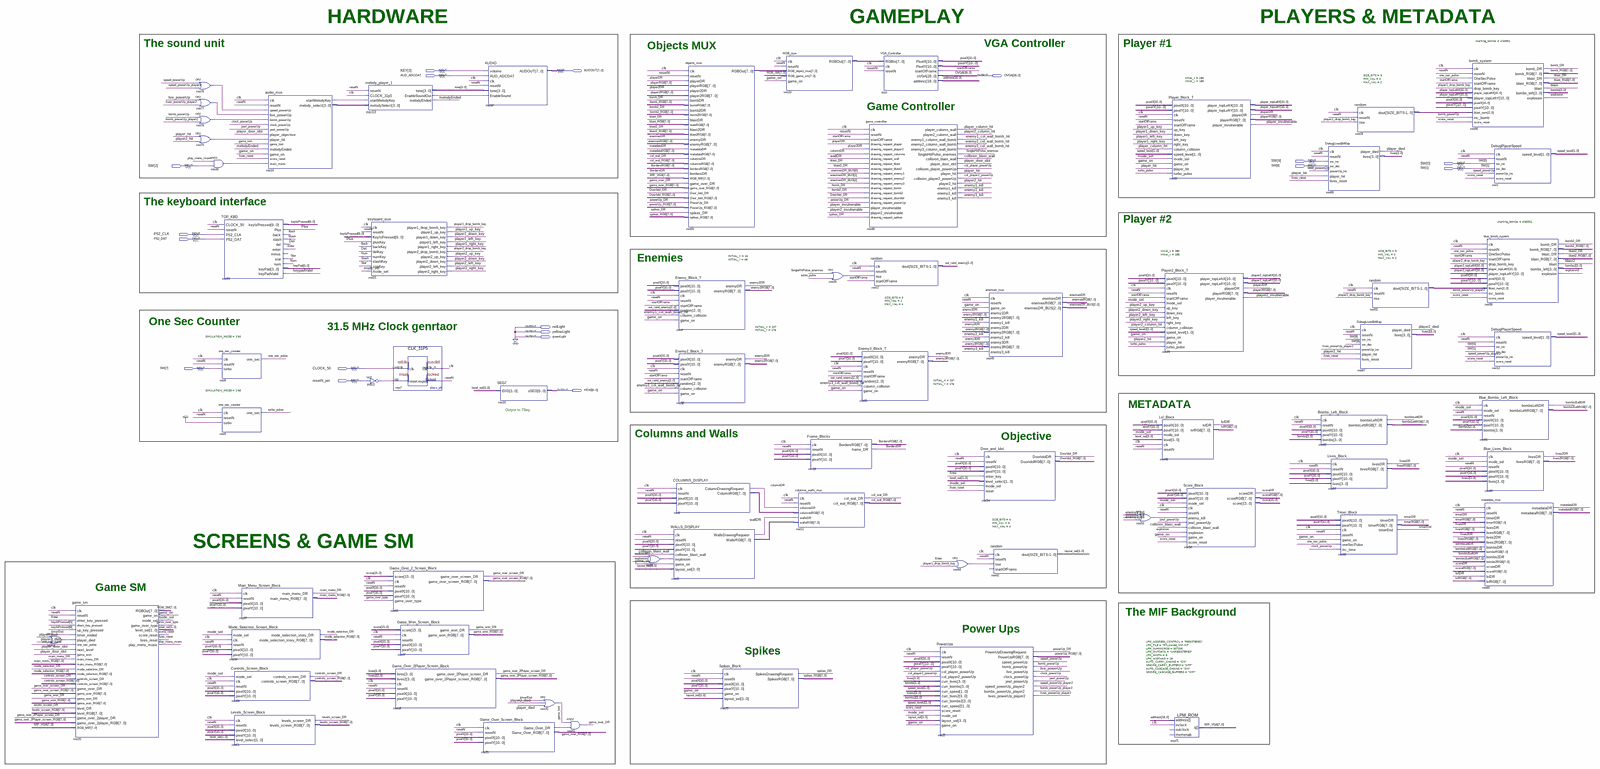
[diagram p0: schematic sheet, whole]
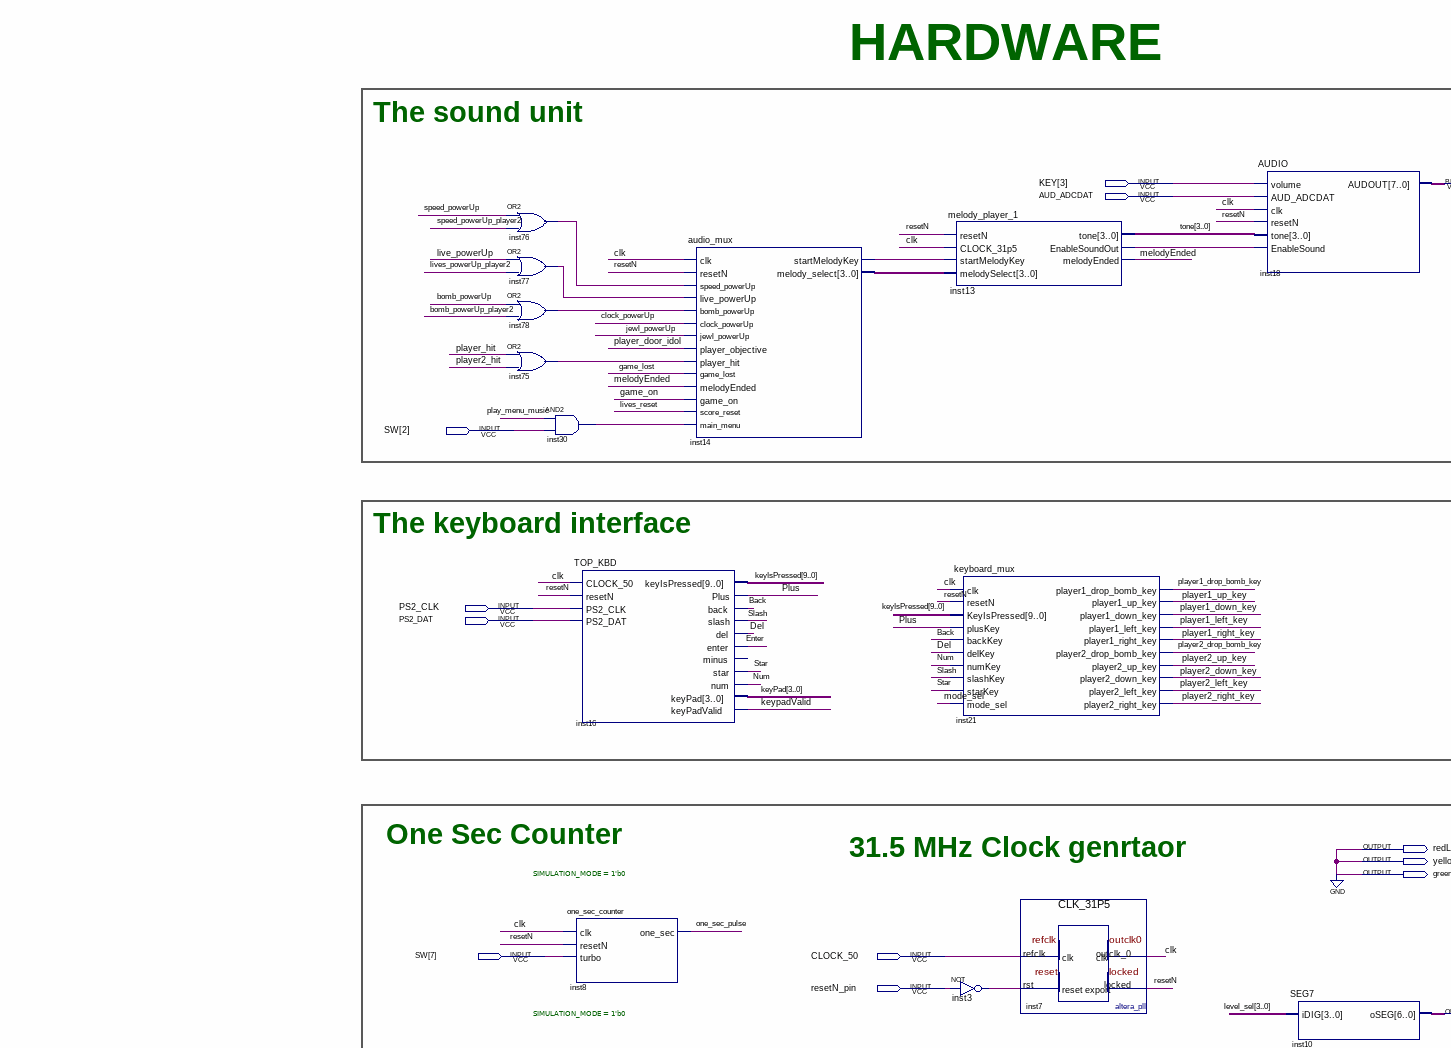
[diagram p1: schematic sheet, upper left part]
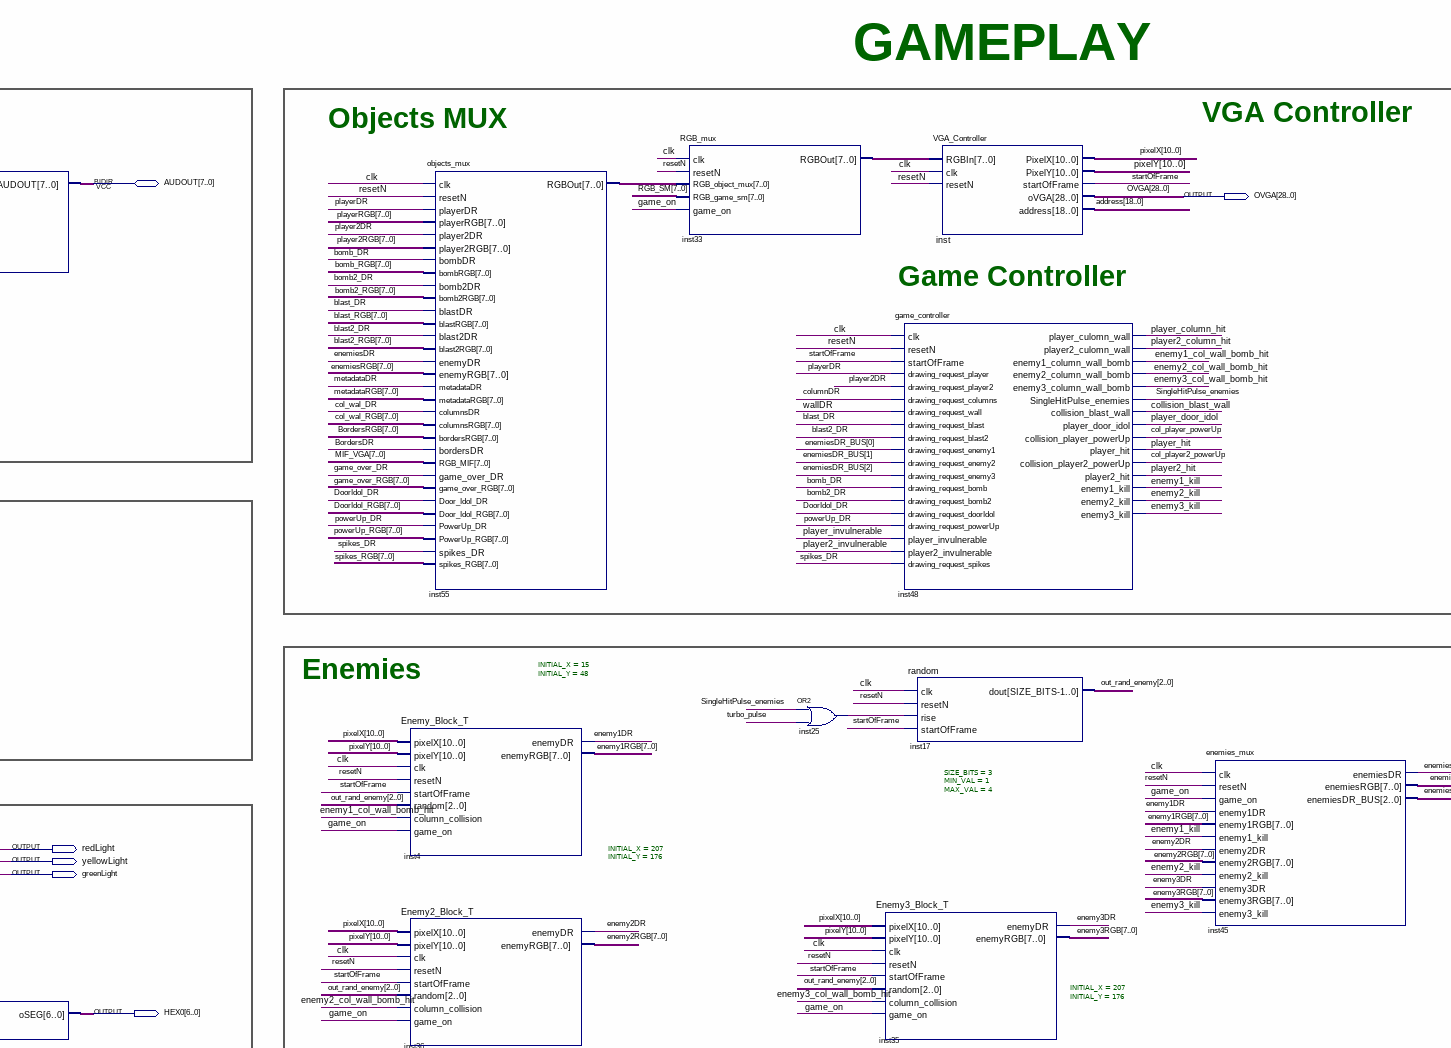
[diagram p2: schematic sheet, upper centre part]
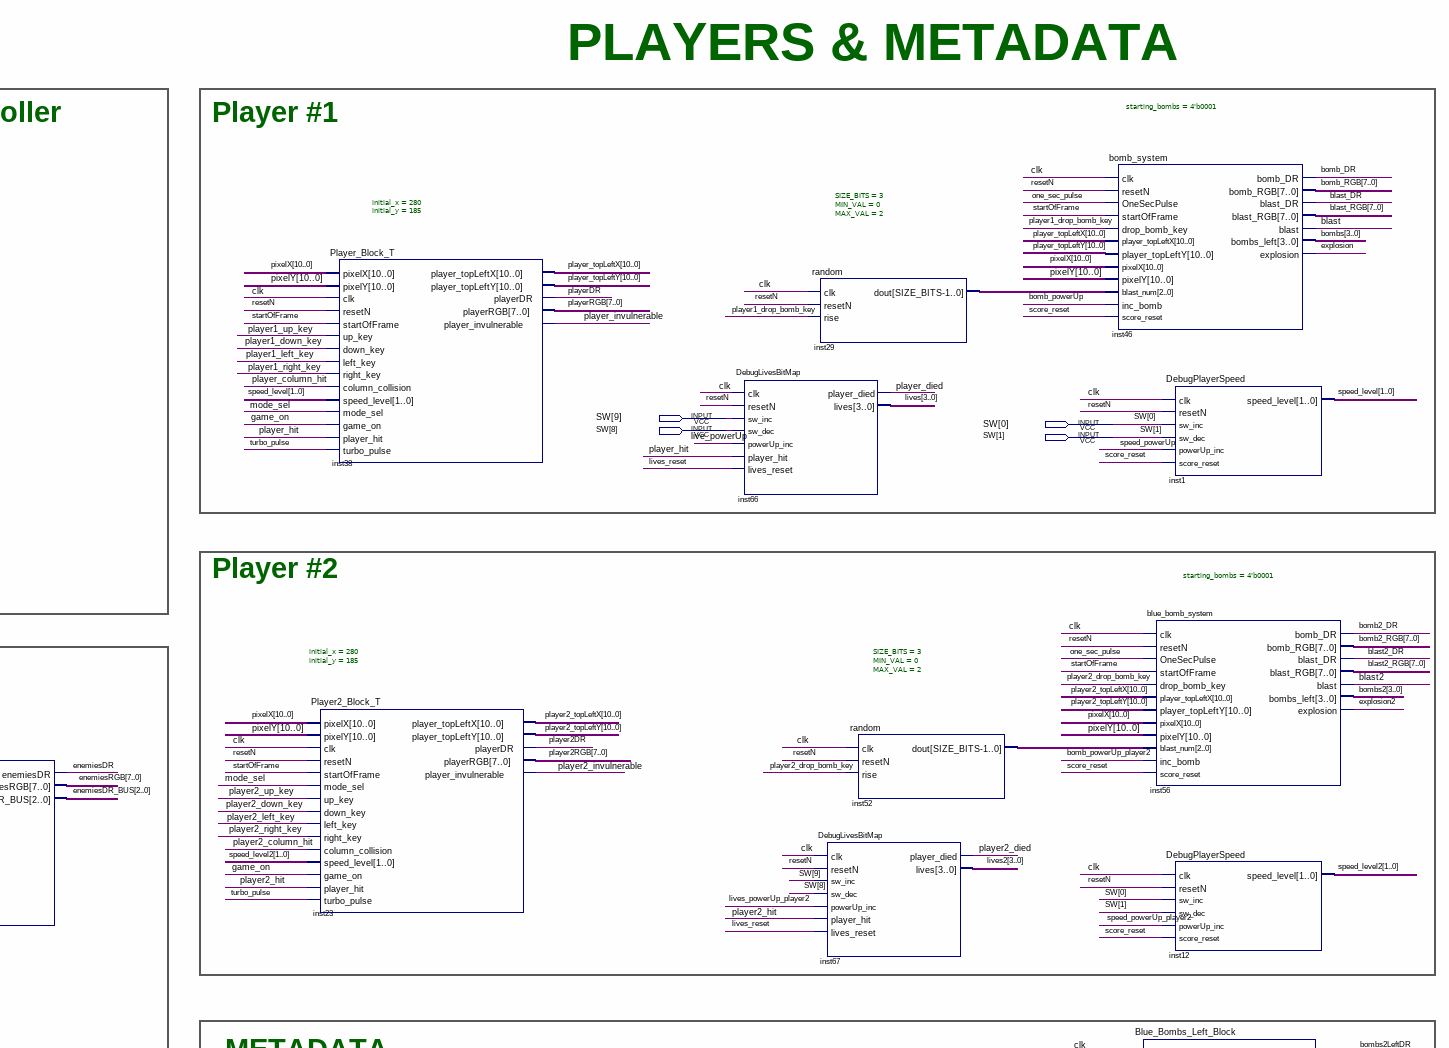
[diagram p3: schematic sheet, upper right part]
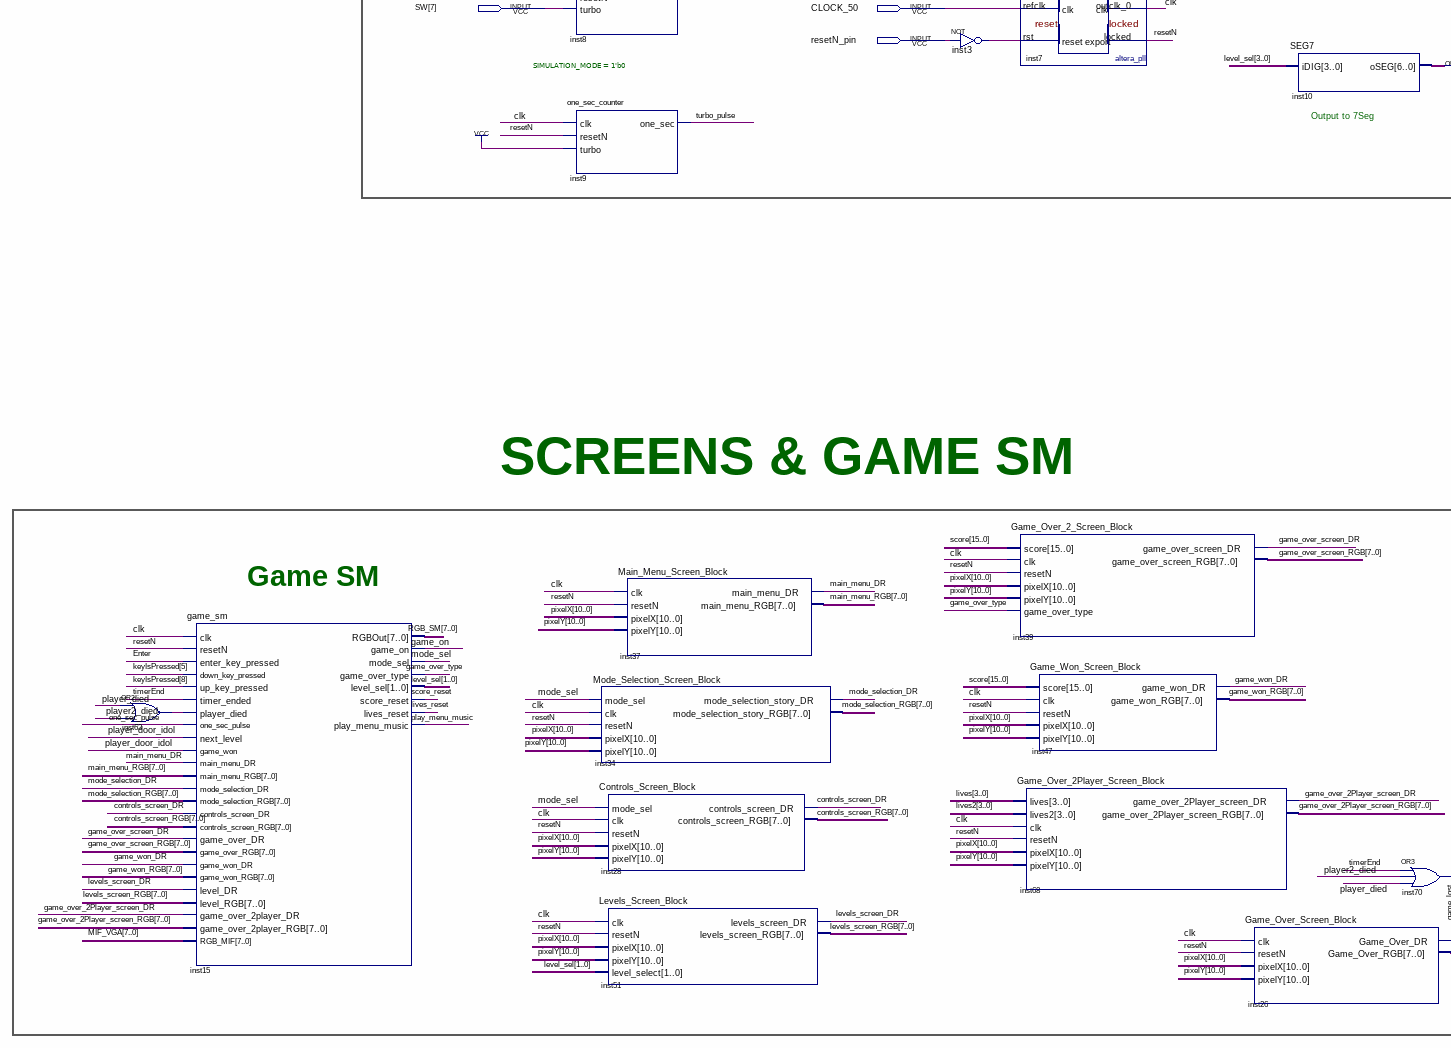
[diagram p4: schematic sheet, lower left part]
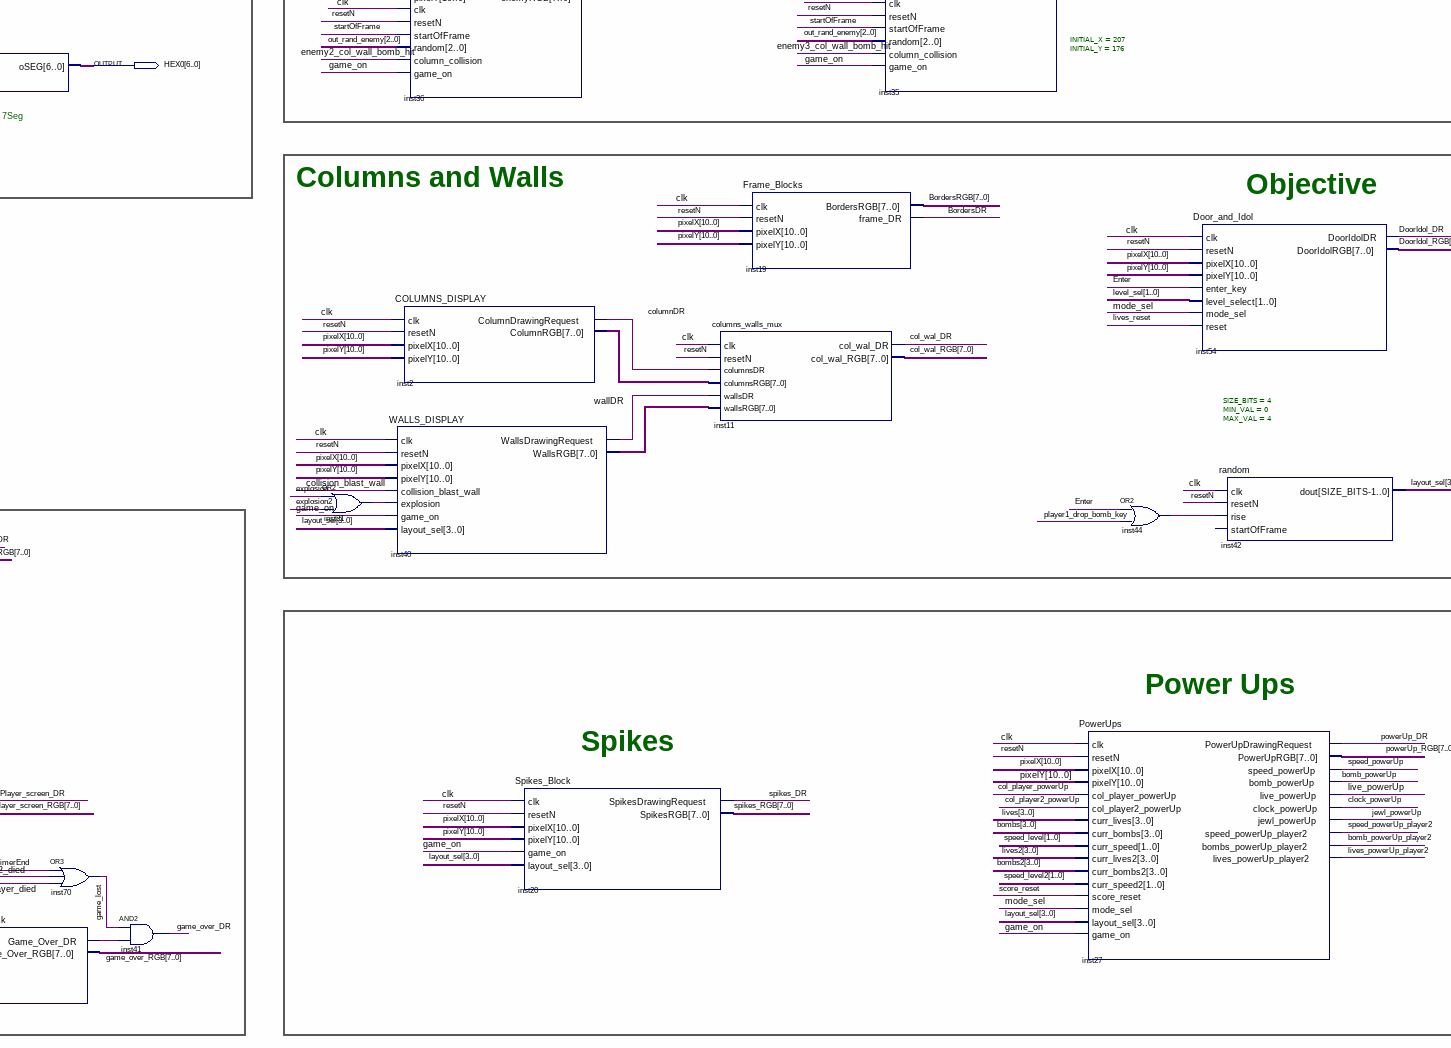
[diagram p5: schematic sheet, lower centre part]
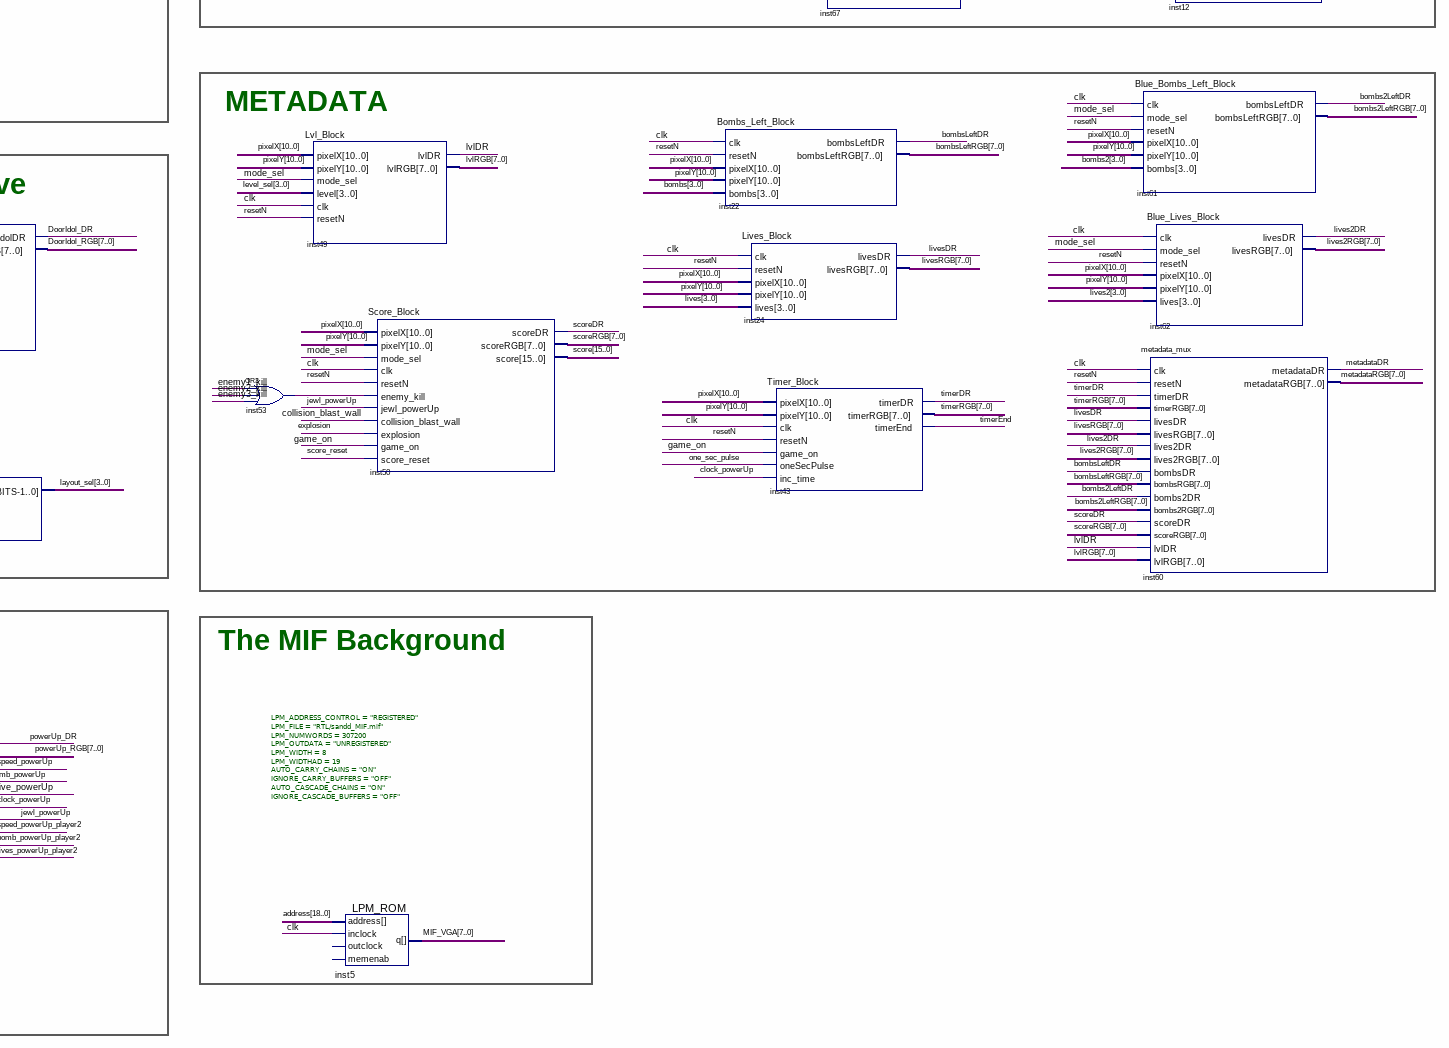
[diagram p6: schematic sheet, lower right part]
// Quartus schematic TOP_VGA_DEMO_KBD.bdf as structural Verilog: 67 symbols, 18 pins
module TOP_VGA_DEMO_KBD (
  input  [3:3] KEY,
  input  AUD_ADCDAT,
  input  [9:0] SW,
  input  PS2_CLK,
  input  PS2_DAT,
  input  CLOCK_50,
  input  resetN_pin,
  inout  [7:0] AUDOUT,
  output [28:0] OVGA,
  output redLight,
  output yellowLight,
  output greenLight,
  output [6:0] HEX0
);

  wire Back, blast, blast2, blast2_DR, blast_DR, bomb2_DR, bomb_DR, bomb_powerUp, bomb_powerUp_player2,
       bombs2LeftDR, bombsLeftDR, BordersDR, clk, clock_powerUp, col_player2_powerUp, col_player_powerUp,
       col_wal_DR, collision_blast_wall, columnDR, controls_screen_DR, Del, DoorIdol_DR, enemiesDR,
       enemy1_col_wall_bomb_hit, enemy1_kill, enemy1DR, enemy2_col_wall_bomb_hit, enemy2_kill, enemy2DR,
       enemy3_col_wall_bomb_hit, enemy3_kill, enemy3DR, Enter, explosion, explosion2, game_lost, game_on,
       game_over_2Player_screen_DR, game_over_DR, game_over_screen_DR, game_over_type, game_won_DR,
       inst3_out, inst13_enablesoundout, inst14_startmelodykey, inst25_out, inst26_game_over_dr, inst30_out,
       inst31_out, inst44_out, inst53_out, inst63_out, inst75_out, inst76_out, inst77_out, inst78_out,
       jewl_powerUp, keypadValid, levels_screen_DR, live_powerUp, lives2DR, lives_powerUp_player2,
       lives_reset, livesDR, lvlDR, main_menu_DR, melodyEnded, metadataDR, mode_sel, mode_selection_DR, Num,
       one_sec_pulse, play_menu_music, player1_down_key, player1_drop_bomb_key, player1_left_key,
       player1_right_key, player1_up_key, player2_column_hit, player2_died, player2_down_key,
       player2_drop_bomb_key, player2_hit, player2_invulnerable, player2_left_key, player2_right_key,
       player2_up_key, player2DR, player_column_hit, player_died, player_door_idol, player_hit,
       player_invulnerable, playerDR, Plus, powerUp_DR, resetN, score_reset, scoreDR, SingleHitPulse_enemies,
       Slash, speed_powerUp, speed_powerUp_player2, spikes_DR, Star, startOfFrame, timerDR, timerEnd,
       turbo_pulse, wallDR;
  wire [1:0] speed_level, speed_level2;
  wire [2:0] enemiesDR_BUS, inst29_dout, inst52_dout, out_rand_enemy;
  wire [3:0] bombs, bombs2, inst14_melody_select, keyPad, layout_sel, level_sel, lives, lives2, tone;
  wire [7:0] blast2_RGB, blast_RGB, bomb2_RGB, bomb_RGB, bombs2LeftRGB, bombsLeftRGB, BordersRGB,
       col_wal_RGB, controls_screen_RGB, DoorIdol_RGB, enemiesRGB, enemy1RGB, enemy2RGB, enemy3RGB,
       game_over_2Player_screen_RGB, game_over_RGB, game_over_screen_RGB, game_won_RGB, inst2_columnrgb,
       inst33_rgbout, inst40_wallsrgb, inst55_rgbout, levels_screen_RGB, lives2RGB, livesRGB, lvlRGB,
       main_menu_RGB, metadataRGB, MIF_VGA, mode_selection_RGB, player2RGB, playerRGB, powerUp_RGB, RGB_SM,
       scoreRGB, spikes_RGB, timerRGB;
  wire [9:0] keyIsPressed;
  wire [10:0] pixelX, pixelY, player2_topLeftX, player2_topLeftY, player_topLeftX, player_topLeftY;
  wire [15:0] score;
  wire [18:0] address;

  or inst63 (inst63_out, player_died, player2_died);
  game_sm inst15 (
    .clk(clk), .resetN(resetN), .enter_key_pressed(Enter), .down_key_pressed(keyIsPressed[5]),
    .up_key_pressed(keyIsPressed[8]), .timer_ended(timerEnd), .player_died(inst63_out),
    .one_sec_pulse(one_sec_pulse), .next_level(player_door_idol), .game_won(player_door_idol),
    .main_menu_DR(main_menu_DR), .main_menu_RGB(main_menu_RGB), .mode_selection_DR(mode_selection_DR),
    .mode_selection_RGB(mode_selection_RGB), .controls_screen_DR(controls_screen_DR),
    .controls_screen_RGB(controls_screen_RGB), .game_over_DR(game_over_screen_DR),
    .game_over_RGB(game_over_screen_RGB), .game_won_DR(game_won_DR), .game_won_RGB(game_won_RGB),
    .level_DR(levels_screen_DR), .level_RGB(levels_screen_RGB),
    .game_over_2player_DR(game_over_2Player_screen_DR), .game_over_2player_RGB(game_over_2Player_screen_RGB),
    .RGB_MIF(MIF_VGA), .RGBOut(RGB_SM), .game_on(game_on), .mode_sel(mode_sel),
    .game_over_type(game_over_type), .level_sel(level_sel[1:0]), .score_reset(score_reset),
    .lives_reset(lives_reset), .play_menu_music(play_menu_music));
  or inst76 (inst76_out, speed_powerUp, speed_powerUp_player2);
  or inst77 (inst77_out, live_powerUp, lives_powerUp_player2);
  or inst78 (inst78_out, bomb_powerUp, bomb_powerUp_player2);
  or inst75 (inst75_out, player_hit, player2_hit);
  and inst30 (inst30_out, play_menu_music, SW[2]);
  TOP_KBD inst16 (
    .CLOCK_50(clk), .resetN(resetN), .PS2_CLK(PS2_CLK), .PS2_DAT(PS2_DAT), .keyIsPressed(keyIsPressed),
    .Plus(Plus), .back(Back), .slash(Slash), .del(Del), .enter(Enter), .star(Star), .num(Num),
    .keyPad(keyPad), .keyPadValid(keypadValid));  // open: minus
  one_sec_counter #(.SIMULATION_MODE(1'b0)) inst8 (.clk(clk), .resetN(resetN), .turbo(SW[7]), .one_sec(one_sec_pulse));
  one_sec_counter #(.SIMULATION_MODE(1'b0)) inst9 (.clk(clk), .resetN(resetN), .turbo(1'b1), .one_sec(turbo_pulse));
  Mode_Selection_Screen_Block inst34 (
    .mode_sel(mode_sel), .clk(clk), .resetN(resetN), .pixelX(pixelX), .pixelY(pixelY),
    .mode_selection_story_DR(mode_selection_DR), .mode_selection_story_RGB(mode_selection_RGB));
  Controls_Screen_Block inst28 (
    .mode_sel(mode_sel), .clk(clk), .resetN(resetN), .pixelX(pixelX), .pixelY(pixelY),
    .controls_screen_DR(controls_screen_DR), .controls_screen_RGB(controls_screen_RGB));
  Levels_Screen_Block inst51 (
    .clk(clk), .resetN(resetN), .pixelX(pixelX), .pixelY(pixelY), .level_select(level_sel[1:0]),
    .levels_screen_DR(levels_screen_DR), .levels_screen_RGB(levels_screen_RGB));
  Main_Menu_Screen_Block inst37 (
    .clk(clk), .resetN(resetN), .pixelX(pixelX), .pixelY(pixelY), .main_menu_DR(main_menu_DR),
    .main_menu_RGB(main_menu_RGB));
  audio_mux inst14 (
    .clk(clk), .resetN(resetN), .speed_powerUp(inst76_out), .live_powerUp(inst77_out),
    .bomb_powerUp(inst78_out), .clock_powerUp(clock_powerUp), .jewl_powerUp(jewl_powerUp),
    .player_objective(player_door_idol), .player_hit(inst75_out), .game_lost(game_lost),
    .melodyEnded(melodyEnded), .game_on(game_on), .score_reset(lives_reset), .main_menu(inst30_out),
    .startMelodyKey(inst14_startmelodykey), .melody_select(inst14_melody_select));
  melody_player_1 inst13 (
    .resetN(resetN), .CLOCK_31p5(clk), .startMelodyKey(inst14_startmelodykey),
    .melodySelect(inst14_melody_select), .tone(tone), .EnableSoundOut(inst13_enablesoundout),
    .melodyEnded(melodyEnded));
  keyboard_mux inst21 (
    .clk(clk), .resetN(resetN), .KeyIsPressed(keyIsPressed), .plusKey(Plus), .backKey(Back), .delKey(Del),
    .numKey(Num), .slashKey(Slash), .starKey(Star), .mode_sel(mode_sel),
    .player1_drop_bomb_key(player1_drop_bomb_key), .player1_up_key(player1_up_key),
    .player1_down_key(player1_down_key), .player1_left_key(player1_left_key),
    .player1_right_key(player1_right_key), .player2_drop_bomb_key(player2_drop_bomb_key),
    .player2_up_key(player2_up_key), .player2_down_key(player2_down_key),
    .player2_left_key(player2_left_key), .player2_right_key(player2_right_key));
  not inst3 (inst3_out, resetN_pin);
  Game_Over_2_Screen_Block inst39 (
    .score(score), .clk(clk), .resetN(resetN), .pixelX(pixelX), .pixelY(pixelY),
    .game_over_type(game_over_type), .game_over_screen_DR(game_over_screen_DR),
    .game_over_screen_RGB(game_over_screen_RGB));
  CLK_31P5 inst7 (.refclk(CLOCK_50), .rst(inst3_out), .outclk_0(clk), .locked(resetN));
  Game_Won_Screen_Block inst47 (
    .score(score), .clk(clk), .resetN(resetN), .pixelX(pixelX), .pixelY(pixelY), .game_won_DR(game_won_DR),
    .game_won_RGB(game_won_RGB));
  Game_Over_2Player_Screen_Block inst68 (
    .lives(lives), .lives2(lives2), .clk(clk), .resetN(resetN), .pixelX(pixelX), .pixelY(pixelY),
    .game_over_2Player_screen_DR(game_over_2Player_screen_DR),
    .game_over_2Player_screen_RGB(game_over_2Player_screen_RGB));
  AUDIO inst18 (
    .volume(KEY[3]), .AUD_ADCDAT(AUD_ADCDAT), .clk(clk), .resetN(resetN), .tone(tone),
    .EnableSound(inst13_enablesoundout), .AUDOUT(AUDOUT));
  Game_Over_Screen_Block inst26 (
    .clk(clk), .resetN(resetN), .pixelX(pixelX), .pixelY(pixelY), .Game_Over_DR(inst26_game_over_dr),
    .Game_Over_RGB(game_over_RGB));
  SEG7 inst10 (.iDIG(level_sel), .oSEG(HEX0));
  or inst70 (game_lost, timerEnd, player2_died, player_died);
  and inst41 (game_over_DR, game_lost, inst26_game_over_dr);
  or inst31 (inst31_out, explosion, explosion2);
  Enemy_Block_T #(.INITIAL_X(15), .INITIAL_Y(48)) inst4 (
    .pixelX(pixelX), .pixelY(pixelY), .clk(clk), .resetN(resetN), .startOfFrame(startOfFrame),
    .random(out_rand_enemy), .column_collision(enemy1_col_wall_bomb_hit), .game_on(game_on),
    .enemyDR(enemy1DR), .enemyRGB(enemy1RGB));
  Enemy2_Block_T #(.INITIAL_X(207), .INITIAL_Y(176)) inst36 (
    .pixelX(pixelX), .pixelY(pixelY), .clk(clk), .resetN(resetN), .startOfFrame(startOfFrame),
    .random(out_rand_enemy), .column_collision(enemy2_col_wall_bomb_hit), .game_on(game_on),
    .enemyDR(enemy2DR), .enemyRGB(enemy2RGB));
  COLUMNS_DISPLAY inst2 (
    .clk(clk), .resetN(resetN), .pixelX(pixelX), .pixelY(pixelY), .ColumnDrawingRequest(columnDR),
    .ColumnRGB(inst2_columnrgb));
  WALLS_DISPLAY inst40 (
    .clk(clk), .resetN(resetN), .pixelX(pixelX), .pixelY(pixelY),
    .collision_blast_wall(collision_blast_wall), .explosion(inst31_out), .game_on(game_on),
    .layout_sel(layout_sel), .WallsDrawingRequest(wallDR), .WallsRGB(inst40_wallsrgb));
  objects_mux inst55 (
    .clk(clk), .resetN(resetN), .playerDR(playerDR), .playerRGB(playerRGB), .player2DR(player2DR),
    .player2RGB(player2RGB), .bombDR(bomb_DR), .bombRGB(bomb_RGB), .bomb2DR(bomb2_DR), .bomb2RGB(bomb2_RGB),
    .blastDR(blast_DR), .blastRGB(blast_RGB), .blast2DR(blast2_DR), .blast2RGB(blast2_RGB),
    .enemyDR(enemiesDR), .enemyRGB(enemiesRGB), .metadataDR(metadataDR), .metadataRGB(metadataRGB),
    .columnsDR(col_wal_DR), .columnsRGB(col_wal_RGB), .bordersRGB(BordersRGB), .bordersDR(BordersDR),
    .RGB_MIF(MIF_VGA), .game_over_DR(game_over_DR), .game_over_RGB(game_over_RGB),
    .Door_Idol_DR(DoorIdol_DR), .Door_Idol_RGB(DoorIdol_RGB), .PowerUp_DR(powerUp_DR),
    .PowerUp_RGB(powerUp_RGB), .spikes_DR(spikes_DR), .spikes_RGB(spikes_RGB), .RGBOut(inst55_rgbout));
  Spikes_Block inst20 (
    .clk(clk), .resetN(resetN), .pixelX(pixelX), .pixelY(pixelY), .game_on(game_on), .layout_sel(layout_sel),
    .SpikesDrawingRequest(spikes_DR), .SpikesRGB(spikes_RGB));
  RGB_mux inst33 (
    .clk(clk), .resetN(resetN), .RGB_object_mux(inst55_rgbout), .RGB_game_sm(RGB_SM), .game_on(game_on),
    .RGBOut(inst33_rgbout));
  columns_walls_mux inst11 (
    .clk(clk), .resetN(resetN), .columnsDR(columnDR), .columnsRGB(inst2_columnrgb), .wallsDR(wallDR),
    .wallsRGB(inst40_wallsrgb), .col_wal_DR(col_wal_DR), .col_wal_RGB(col_wal_RGB));
  Frame_Blocks inst19 (
    .clk(clk), .resetN(resetN), .pixelX(pixelX), .pixelY(pixelY), .BordersRGB(BordersRGB),
    .frame_DR(BordersDR));
  or inst25 (inst25_out, SingleHitPulse_enemies, turbo_pulse);
  Enemy3_Block_T #(.INITIAL_X(207), .INITIAL_Y(176)) inst35 (
    .pixelX(pixelX), .pixelY(pixelY), .clk(clk), .resetN(resetN), .startOfFrame(startOfFrame),
    .random(out_rand_enemy), .column_collision(enemy3_col_wall_bomb_hit), .game_on(game_on),
    .enemyDR(enemy3DR), .enemyRGB(enemy3RGB));
  game_controller inst48 (
    .clk(clk), .resetN(resetN), .startOfFrame(startOfFrame), .drawing_request_player(playerDR),
    .drawing_request_player2(player2DR), .drawing_request_columns(columnDR), .drawing_request_wall(wallDR),
    .drawing_request_blast(blast_DR), .drawing_request_blast2(blast2_DR),
    .drawing_request_enemy1(enemiesDR_BUS[0]), .drawing_request_enemy2(enemiesDR_BUS[1]),
    .drawing_request_enemy3(enemiesDR_BUS[2]), .drawing_request_bomb(bomb_DR),
    .drawing_request_bomb2(bomb2_DR), .drawing_request_doorIdol(DoorIdol_DR),
    .drawing_request_powerUp(powerUp_DR), .player_invulnerable(player_invulnerable),
    .player2_invulnerable(player2_invulnerable), .drawing_request_spikes(spikes_DR),
    .player_culomn_wall(player_column_hit), .player2_culomn_wall(player2_column_hit),
    .enemy1_column_wall_bomb(enemy1_col_wall_bomb_hit), .enemy2_column_wall_bomb(enemy2_col_wall_bomb_hit),
    .enemy3_column_wall_bomb(enemy3_col_wall_bomb_hit), .SingleHitPulse_enemies(SingleHitPulse_enemies),
    .collision_blast_wall(collision_blast_wall), .player_door_idol(player_door_idol),
    .collision_player_powerUp(col_player_powerUp), .player_hit(player_hit),
    .collision_player2_powerUp(col_player2_powerUp), .player2_hit(player2_hit), .enemy1_kill(enemy1_kill),
    .enemy2_kill(enemy2_kill), .enemy3_kill(enemy3_kill));
  random #(.SIZE_BITS(3), .MIN_VAL(1), .MAX_VAL(4)) inst17 (
    .clk(clk), .resetN(resetN), .rise(inst25_out), .startOfFrame(startOfFrame), .dout(out_rand_enemy));
  VGA_Controller inst (
    .RGBIn(inst33_rgbout), .clk(clk), .resetN(resetN), .PixelX(pixelX), .PixelY(pixelY),
    .startOfFrame(startOfFrame), .oVGA(OVGA), .address(address));
  PowerUps inst27 (
    .clk(clk), .resetN(resetN), .pixelX(pixelX), .pixelY(pixelY), .col_player_powerUp(col_player_powerUp),
    .col_player2_powerUp(col_player2_powerUp), .curr_lives(lives), .curr_bombs(bombs),
    .curr_speed(speed_level), .curr_lives2(lives2), .curr_bombs2(bombs2), .curr_speed2(speed_level2),
    .score_reset(score_reset), .mode_sel(mode_sel), .layout_sel(layout_sel), .game_on(game_on),
    .PowerUpDrawingRequest(powerUp_DR), .PowerUpRGB(powerUp_RGB), .speed_powerUp(speed_powerUp),
    .bomb_powerUp(bomb_powerUp), .live_powerUp(live_powerUp), .clock_powerUp(clock_powerUp),
    .jewl_powerUp(jewl_powerUp), .speed_powerUp_player2(speed_powerUp_player2),
    .bombs_powerUp_player2(bomb_powerUp_player2), .lives_powerUp_player2(lives_powerUp_player2));
  or inst44 (inst44_out, Enter, player1_drop_bomb_key);
  enemies_mux inst45 (
    .clk(clk), .resetN(resetN), .game_on(game_on), .enemy1DR(enemy1DR), .enemy1RGB(enemy1RGB),
    .enemy1_kill(enemy1_kill), .enemy2DR(enemy2DR), .enemy2RGB(enemy2RGB), .enemy2_kill(enemy2_kill),
    .enemy3DR(enemy3DR), .enemy3RGB(enemy3RGB), .enemy3_kill(enemy3_kill), .enemiesDR(enemiesDR),
    .enemiesRGB(enemiesRGB), .enemiesDR_BUS(enemiesDR_BUS));
  Door_and_Idol inst54 (
    .clk(clk), .resetN(resetN), .pixelX(pixelX), .pixelY(pixelY), .enter_key(Enter),
    .level_select(level_sel[1:0]), .mode_sel(mode_sel), .reset(lives_reset), .DoorIdolDR(DoorIdol_DR),
    .DoorIdolRGB(DoorIdol_RGB));
  random #(.SIZE_BITS(4), .MIN_VAL(0), .MAX_VAL(4)) inst42 (
    .clk(clk), .resetN(resetN), .rise(inst44_out), .dout(layout_sel));  // open: startOfFrame
  or inst53 (inst53_out, enemy1_kill, enemy2_kill, enemy3_kill);
  Player_Block_T #(.initial_x(280), .initial_y(185)) inst38 (
    .pixelX(pixelX), .pixelY(pixelY), .clk(clk), .resetN(resetN), .startOfFrame(startOfFrame),
    .up_key(player1_up_key), .down_key(player1_down_key), .left_key(player1_left_key),
    .right_key(player1_right_key), .column_collision(player_column_hit), .speed_level(speed_level),
    .mode_sel(mode_sel), .game_on(game_on), .player_hit(player_hit), .turbo_pulse(turbo_pulse),
    .player_topLeftX(player_topLeftX), .player_topLeftY(player_topLeftY), .playerDR(playerDR),
    .playerRGB(playerRGB), .player_invulnerable(player_invulnerable));
  Player2_Block_T #(.initial_x(280), .initial_y(185)) inst23 (
    .pixelX(pixelX), .pixelY(pixelY), .clk(clk), .resetN(resetN), .startOfFrame(startOfFrame),
    .mode_sel(mode_sel), .up_key(player2_up_key), .down_key(player2_down_key), .left_key(player2_left_key),
    .right_key(player2_right_key), .column_collision(player2_column_hit), .speed_level(speed_level2),
    .game_on(game_on), .player_hit(player2_hit), .turbo_pulse(turbo_pulse),
    .player_topLeftX(player2_topLeftX), .player_topLeftY(player2_topLeftY), .playerDR(player2DR),
    .playerRGB(player2RGB), .player_invulnerable(player2_invulnerable));
  Lvl_Block inst49 (
    .pixelX(pixelX), .pixelY(pixelY), .mode_sel(mode_sel), .level(level_sel), .clk(clk), .resetN(resetN),
    .lvlDR(lvlDR), .lvlRGB(lvlRGB));
  LPM_ROM #(.LPM_ADDRESS_CONTROL("REGISTERED"), .LPM_FILE("RTL/sandd_MIF.mif"), .LPM_NUMWORDS(307200), .LPM_OUTDATA("UNREGISTERED"), .LPM_WIDTH(8), .LPM_WIDTHAD(19), .AUTO_CARRY_CHAINS("ON"), .IGNORE_CARRY_BUFFERS("OFF"), .AUTO_CASCADE_CHAINS("ON"), .IGNORE_CASCADE_BUFFERS("OFF")) inst5 (
    .address(address), .inclock(clk), .q(MIF_VGA));  // open: outclock, memenab
  Score_Block inst50 (
    .pixelX(pixelX), .pixelY(pixelY), .mode_sel(mode_sel), .clk(clk), .resetN(resetN),
    .enemy_kill(inst53_out), .jewl_powerUp(jewl_powerUp), .collision_blast_wall(collision_blast_wall),
    .explosion(explosion), .game_on(game_on), .score_reset(score_reset), .scoreDR(scoreDR),
    .scoreRGB(scoreRGB), .score(score));
  DebugLivesBitMap inst66 (
    .clk(clk), .resetN(resetN), .sw_inc(SW[9]), .sw_dec(SW[8]), .powerUp_inc(live_powerUp),
    .player_hit(player_hit), .lives_reset(lives_reset), .player_died(player_died), .lives(lives));
  Bombs_Left_Block inst22 (
    .clk(clk), .resetN(resetN), .pixelX(pixelX), .pixelY(pixelY), .bombs(bombs), .bombsLeftDR(bombsLeftDR),
    .bombsLeftRGB(bombsLeftRGB));
  Lives_Block inst24 (
    .clk(clk), .resetN(resetN), .pixelX(pixelX), .pixelY(pixelY), .lives(lives), .livesDR(livesDR),
    .livesRGB(livesRGB));
  Timer_Block inst43 (
    .pixelX(pixelX), .pixelY(pixelY), .clk(clk), .resetN(resetN), .game_on(game_on),
    .oneSecPulse(one_sec_pulse), .inc_time(clock_powerUp), .timerDR(timerDR), .timerRGB(timerRGB),
    .timerEnd(timerEnd));
  random #(.SIZE_BITS(3), .MIN_VAL(0), .MAX_VAL(2)) inst29 (
    .clk(clk), .resetN(resetN), .rise(player1_drop_bomb_key), .dout(inst29_dout));
  DebugLivesBitMap inst67 (
    .clk(clk), .resetN(resetN), .sw_inc(SW[9]), .sw_dec(SW[8]), .powerUp_inc(lives_powerUp_player2),
    .player_hit(player2_hit), .lives_reset(lives_reset), .player_died(player2_died), .lives(lives2));
  random #(.SIZE_BITS(3), .MIN_VAL(0), .MAX_VAL(2)) inst52 (
    .clk(clk), .resetN(resetN), .rise(player2_drop_bomb_key), .dout(inst52_dout));
  bomb_system #(.starting_bombs(4'b0001)) inst46 (
    .clk(clk), .resetN(resetN), .OneSecPulse(one_sec_pulse), .startOfFrame(startOfFrame),
    .drop_bomb_key(player1_drop_bomb_key), .player_topLeftX(player_topLeftX),
    .player_topLeftY(player_topLeftY), .pixelX(pixelX), .pixelY(pixelY), .blast_num(inst29_dout),
    .inc_bomb(bomb_powerUp), .score_reset(score_reset), .bomb_DR(bomb_DR), .bomb_RGB(bomb_RGB),
    .blast_DR(blast_DR), .blast_RGB(blast_RGB), .blast(blast), .bombs_left(bombs), .explosion(explosion));
  blue_bomb_system #(.starting_bombs(4'b0001)) inst56 (
    .clk(clk), .resetN(resetN), .OneSecPulse(one_sec_pulse), .startOfFrame(startOfFrame),
    .drop_bomb_key(player2_drop_bomb_key), .player_topLeftX(player2_topLeftX),
    .player_topLeftY(player2_topLeftY), .pixelX(pixelX), .pixelY(pixelY), .blast_num(inst52_dout),
    .inc_bomb(bomb_powerUp_player2), .score_reset(score_reset), .bomb_DR(bomb2_DR), .bomb_RGB(bomb2_RGB),
    .blast_DR(blast2_DR), .blast_RGB(blast2_RGB), .blast(blast2), .bombs_left(bombs2), .explosion(explosion2));
  Blue_Bombs_Left_Block inst61 (
    .clk(clk), .mode_sel(mode_sel), .resetN(resetN), .pixelX(pixelX), .pixelY(pixelY), .bombs(bombs2),
    .bombsLeftDR(bombs2LeftDR), .bombsLeftRGB(bombs2LeftRGB));
  Blue_Lives_Block inst62 (
    .clk(clk), .mode_sel(mode_sel), .resetN(resetN), .pixelX(pixelX), .pixelY(pixelY), .lives(lives2),
    .livesDR(lives2DR), .livesRGB(lives2RGB));
  metadata_mux inst60 (
    .clk(clk), .resetN(resetN), .timerDR(timerDR), .timerRGB(timerRGB), .livesDR(livesDR),
    .livesRGB(livesRGB), .lives2DR(lives2DR), .lives2RGB(lives2RGB), .bombsDR(bombsLeftDR),
    .bombsRGB(bombsLeftRGB), .bombs2DR(bombs2LeftDR), .bombs2RGB(bombs2LeftRGB), .scoreDR(scoreDR),
    .scoreRGB(scoreRGB), .lvlDR(lvlDR), .lvlRGB(lvlRGB), .metadataDR(metadataDR), .metadataRGB(metadataRGB));
  DebugPlayerSpeed inst1 (
    .clk(clk), .resetN(resetN), .sw_inc(SW[0]), .sw_dec(SW[1]), .powerUp_inc(speed_powerUp),
    .score_reset(score_reset), .speed_level(speed_level));
  DebugPlayerSpeed inst12 (
    .clk(clk), .resetN(resetN), .sw_inc(SW[0]), .sw_dec(SW[1]), .powerUp_inc(speed_powerUp_player2),
    .score_reset(score_reset), .speed_level(speed_level2));

  assign greenLight = 1'b0;
  assign redLight = 1'b0;
  assign yellowLight = 1'b0;

  // Notes on the sheet:
  //   HARDWARE
  //   GAMEPLAY
  //   PLAYERS & METADATA
  //   The sound unit
  //   VGA Controller
  //   Player #1
  //   Objects MUX
  //   Game Controller
  //   The keyboard interface
  //   Player #2
  //   Enemies
  //   One Sec Counter
  //   31.5 MHz Clock genrtaor
  //   METADATA
  //   Output to 7Seg
  //   Columns and Walls
  //   Objective
  //   SCREENS & GAME SM
  //   Game SM
  //   The MIF Background
  //   Power Ups
  //   Spikes
endmodule
